# EAGLE design Nodino-CM4 (EAGLE 6.5.0)
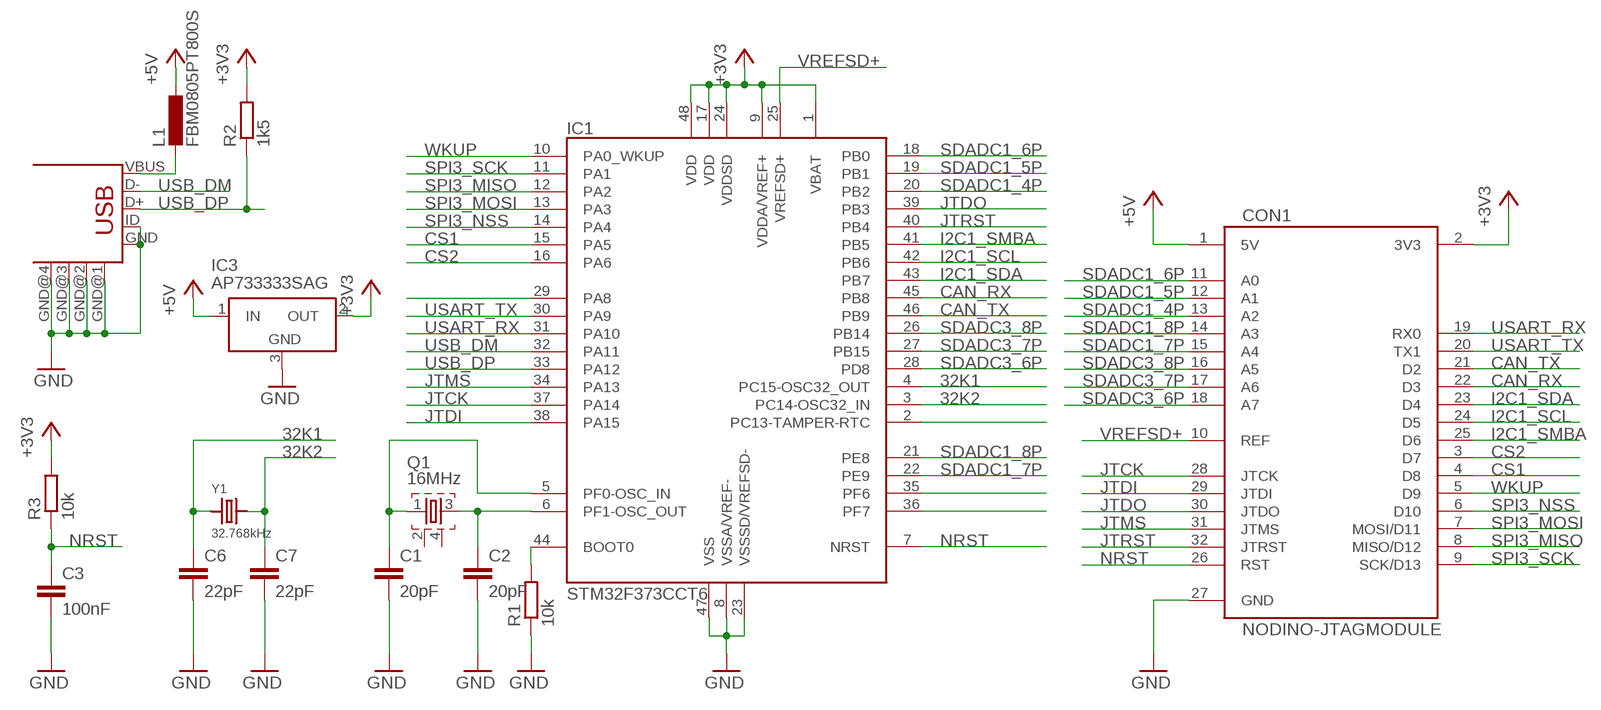
[diagram p0: schematic, sheet 1]

## Parts
C1  20pF  C-EUC0603K  [C0603K]
C2  20pF  C-EUC0603K  [C0603K]
C3  100nF  C-EUC0603K  [C0603K]
C6  22pF  C-EUC0603K  [C0603K]
C7  22pF  C-EUC0603K  [C0603K]
CON1  NODINO-JTAGMODULE  [NODINO-JTAG-MOD]
CON2  USB-OTG_SHIELD  [USB-UAB-S1]
IC1  STM32F373CCT6  [LQFP48]
IC3  AP733333SAG  [SOT23]
L1  FBM0805PT800S  L-EUL0805  [L0805]
Q1  16MHz  FA-20H  [FA-20H]
R1  10k  R-EU_R0603K  [R0603K]
R2  1k5  R-EU_R0603K  [R0603K]
R3  10k  R-EU_R0603K  [R0603K]
Y1  32.768kHz  CRYSTAL.ABS07  [ABS07]

## Nets
32K1: C6.1 IC1.4(PC15-OSC32_OUT) Y1.1
32K2: C7.1 IC1.3(PC14-OSC32_IN) Y1.2
+3V3: CON1.2(3V3) IC1.1(VBAT) IC1.9(VDDA/VREF+) IC1.17(VDD) IC1.24(VDDSD) IC1.48(VDD) IC3.2(OUT) R2.2 R3.2
+5V: CON1.1(5V) IC3.1(IN) L1.1
CAN_RX: CON1.22(D3) IC1.45(PB8)
CAN_TX: CON1.21(D2) IC1.46(PB9)
CS1: CON1.4(D8) IC1.15(PA5)
CS2: CON1.3(D7) IC1.16(PA6)
GND: C1.2 C2.2 C3.2 C6.2 C7.2 CON1.27(GND) CON2.GND CON2.GND@1(GND) CON2.GND@2(GND) CON2.GND@3(GND) CON2.GND@4(GND) CON2.ID IC1.8(VSSA/VREF-) IC1.23(VSSSD/VREFSD-) IC1.47(VSS) IC3.3(GND) R1.1
I2C1_SCL: CON1.24(D5) IC1.42(PB6)
I2C1_SDA: CON1.23(D4) IC1.43(PB7)
I2C1_SMBA: CON1.25(D6) IC1.41(PB5)
JTCK: CON1.28(JTCK) IC1.37(PA14)
JTDI: CON1.29(JTDI) IC1.38(PA15)
JTDO: CON1.30(JTDO) IC1.39(PB3)
JTMS: CON1.31(JTMS) IC1.34(PA13)
JTRST: CON1.32(JTRST) IC1.40(PB4)
N$1: CON2.VBUS L1.2
N$6: IC1.44(BOOT0) R1.2
N$7: C2.1 IC1.6(PF1-OSC_OUT) Q1.3
N$8: C1.1 IC1.5(PF0-OSC_IN) Q1.1
NRST: C3.1 CON1.26(RST) IC1.7(NRST) R3.1
PA8: IC1.29(PA8)
PC13: IC1.2(PC13-TAMPER-RTC)
PF6: IC1.35(PF6)
PF7: IC1.36(PF7)
SDADC1_4P: CON1.13(A2) IC1.20(PB2)
SDADC1_5P: CON1.12(A1) IC1.19(PB1)
SDADC1_6P: CON1.11(A0) IC1.18(PB0)
SDADC1_7P: CON1.15(A4) IC1.22(PE9)
SDADC1_8P: CON1.14(A3) IC1.21(PE8)
SDADC3_6P: CON1.18(A7) IC1.28(PD8)
SDADC3_7P: CON1.17(A6) IC1.27(PB15)
SDADC3_8P: CON1.16(A5) IC1.26(PB14)
SPI3_MISO: CON1.8(MISO/D12) IC1.12(PA2)
SPI3_MOSI: CON1.7(MOSI/D11) IC1.13(PA3)
SPI3_NSS: CON1.6(D10) IC1.14(PA4)
SPI3_SCK: CON1.9(SCK/D13) IC1.11(PA1)
USART_RX: CON1.19(RX0) IC1.31(PA10)
USART_TX: CON1.20(TX1) IC1.30(PA9)
USB_DM: CON2.D- IC1.32(PA11)
USB_DP: CON2.D+ IC1.33(PA12) R2.1
VREFSD+: CON1.10(REF) IC1.25(VREFSD+)
WKUP: CON1.5(D9) IC1.10(PA0_WKUP)
Unconnected: Q1.2 Q1.4

## Library data of the parts
C1-C3 C6 C7 = resistor:C-EU: CAPACITOR, European symbol
CON1 = nodino:NODINO-JTAG
CON2 = con-usb-2:USB-OTG_SHIELD
IC1 = stm32fxxx:STM32F373C
IC3 = diodes_inc:AP7333
L1 = resistor:L-EU: INDUCTOR, European symbol
Q1 = crystal:FA-: MHz RANGE CRYSTAL UNIT Source: Epson Toyocom
R1-R3 = resistor:R-EU_: RESISTOR, European symbol
Y1 = abracon:CRYSTAL

## Board
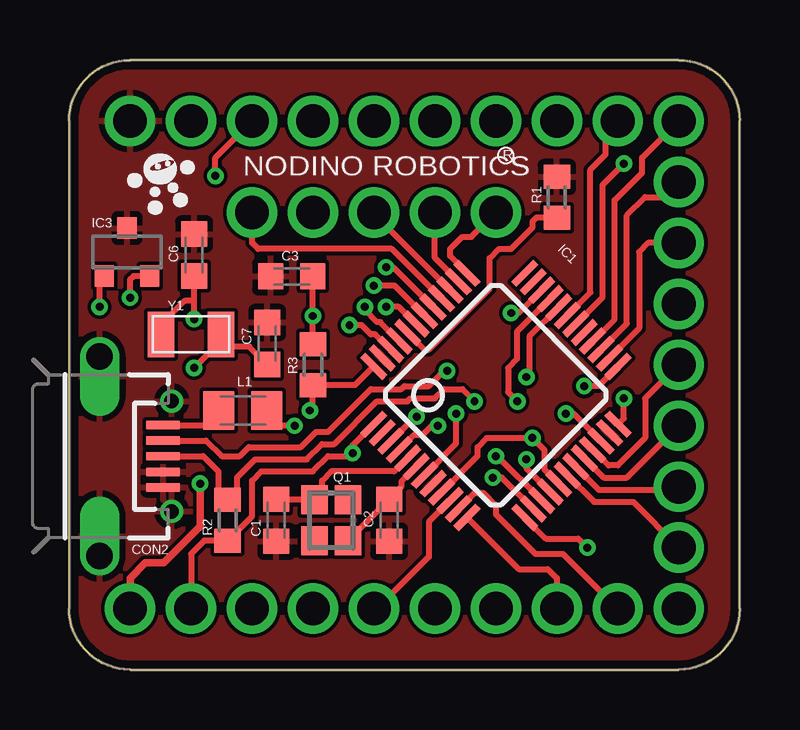
[diagram p1: board, top side]
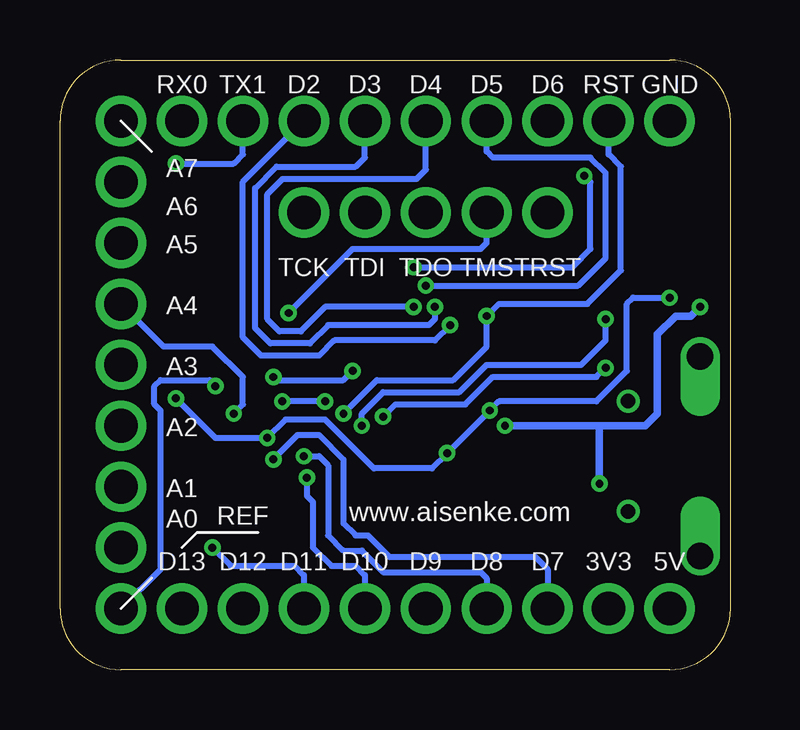
[diagram p2: board, bottom side, seen from below]

Size 27.94 x 25.4 mm. Coordinates in mm from the lower left corner, seen from the top.
Outline: 0,2.54 0,22.86 arc-90 2.54,25.4 25.4,25.4 arc-90 27.94,22.86 27.94,2.54 arc-90 25.4,0 2.54,0 arc-90 0,2.54
Copper layers (1*16): Top 0.0356mm / dielectric 1.5011mm / Bottom 0.0356mm
Design rules "LaenPCBOrder": minimum track width 6mil, minimum drill 13mil, track to track 6mil, track to pad 6mil, pad to pad 6mil, via to via 6mil, smd to smd 6mil, copper to edge 15mil, drill to drill 6mil, minimum pad ring 7mil, minimum via ring 7mil, stop-mask expansion 3mil, vias tented up to drill 0mil, thermal gap 10mil

### Footprints (pad centres in the part's own frame; a part is rotated, then mirrored left to right if it is on the bottom)
C0603K = smd 1.05 x 1.08: 1 -0.875,0; 2 0.875,0
NODINO-JTAG-MOD = drill 1.4 pad 2.1: 1 -11.43,-10.16; 2 -8.89,-10.16; 3 -6.35,-10.16; 4 -3.81,-10.16; 5 -1.27,-10.16; 6 1.27,-10.16; 7 3.81,-10.16; 8 6.35,-10.16; 9 8.89,-10.16; 10 11.43,-10.16; 11 11.43,-7.62; 12 11.43,-5.08; 13 11.43,-2.54; 14 11.43,0; 15 11.43,2.54; 16 11.43,5.08; 17 11.43,7.62; 18 11.43,10.16; 19 8.89,10.16; 20 6.35,10.16; 21 3.81,10.16; 22 1.27,10.16; 23 -1.27,10.16; 24 -3.81,10.16; 25 -6.35,10.16; 26 -8.89,10.16; 27 -11.43,10.16; 28 3.81,6.35; 29 1.27,6.35; 30 -1.27,6.35; 31 -3.81,6.35; 32 -6.35,6.35
USB-UAB-S1 = smd 0.35 x 1.4: D+ 0,2.65; D- -0.65,2.65; GND 1.3,2.65; ID 0.65,2.65; VBUS -1.3,2.65 | drill 0.6: GND@1 -2.3,3; GND@2 2.3,3 | drill 1.1 offset: GND@3 -4.15,0; GND@4 4.15,0
LQFP48 = smd 0.3 x 1.3: 1 -2.75,-4.45; 2 -2.25,-4.45; 3 -1.75,-4.45; 4 -1.25,-4.45; 5 -0.75,-4.45; 6 -0.25,-4.45; 7 0.25,-4.45; 8 0.75,-4.45; 9 1.25,-4.45; 10 1.75,-4.45; 11 2.25,-4.45; 12 2.75,-4.45; 25 2.75,4.45; 26 2.25,4.45; 27 1.75,4.45; 28 1.25,4.45; 29 0.75,4.45; 30 0.25,4.45; 31 -0.25,4.45; 32 -0.75,4.45; 33 -1.25,4.45; 34 -1.75,4.45; 35 -2.25,4.45; 36 -2.75,4.45 | smd 1.3 x 0.3: 13 4.45,-2.75; 14 4.45,-2.25; 15 4.45,-1.75; 16 4.45,-1.25; 17 4.45,-0.75; 18 4.45,-0.25; 19 4.45,0.25; 20 4.45,0.75; 21 4.45,1.25; 22 4.45,1.75; 23 4.45,2.25; 24 4.45,2.75; 37 -4.45,2.75; 38 -4.45,2.25; 39 -4.45,1.75; 40 -4.45,1.25; 41 -4.45,0.75; 42 -4.45,0.25; 43 -4.45,-0.25; 44 -4.45,-0.75; 45 -4.45,-1.25; 46 -4.45,-1.75; 47 -4.45,-2.25; 48 -4.45,-2.75
SOT23 = smd 0.8 x 0.9: 1 -0.95,-1; 2 0.95,-1; 3 0,1
L0805 = smd 1.3 x 1.6: 1 -1,0; 2 1,0
FA-20H = smd 1.2 x 1.1: 1 -0.85,-0.7; 2 0.85,-0.7; 3 0.85,0.7; 4 -0.85,0.7
R0603K = smd 1 x 1.1: 1 -0.85,0; 2 0.85,0
ABS07 = smd 1.1 x 1.9: 1 -1.25,0; 2 1.25,0

### Placement (x,y rotation side)
C1  8.64,6.22 270 top
C2  13.34,6.22 270 top
C3  9.27,16.38 180 top
C6  5.21,17.27 90 top
C7  8.26,13.59 90 top
CON1  13.97,12.7 0 top
CON2  1.27,8.89 270 top
IC1  17.78,11.43 315 top
IC3  2.41,17.4 0 top
L1  7.24,10.79 180 top
Q1  10.92,6.22 270 top
R1  20.32,19.68 270 top
R2  6.6,6.22 270 top
R3  10.16,12.7 270 top
Y1  5.08,13.97 0 top

### Tracks (layer width: path | path; a pad name or v marks a point on that pad's centre or on a via)
32K1  (via drill 0.33)
  Top 0.254: IC1.4 14.36,9.78 14.73,9.78 15.11,10.16 v15.37,10.16 | 5.21,15.37 4.83,15.37 3.83,14.37 Y1.1 | v5.21,14.61 5.21,15.37 | 5.21,15.37 C6.1
  Bottom 0.254: v15.37,10.16 15.37,10.67 14.48,11.56 11.3,11.56 10.16,12.7 6.22,12.7 5.21,13.72 v5.21,14.61
32K2  (via drill 0.33)
  Top 0.254: v14.48,10.54 14.42,10.54 IC1.3 | C7.1 7.51,13.46 6.73,13.46 6.33,13.86 Y1.2 6.33,13.7 v5.21,12.57
  Bottom 0.254: v14.48,10.54 13.97,11.05 11.05,11.05 9.91,12.19 5.59,12.19 v5.21,12.57
+3V3  (via drill 0.33)
  Top 0.254: IC1.24 23.11,10.47 v23.11,11.3 | IC1.9 17.02,8.9 17.02,9.27 17.4,9.65 v19.3,9.65 19.81,9.14 19.81,8.34 IC1.17 | CON1.2 5.08,4.83 5.63,5.37 R2.2 7.62,6.39 7.62,7.87 8,8.26 10.16,8.26 10.79,8.89 11.68,8.89 v11.81,9.02 11.81,9.35 IC1.1 | IC1.48 11.91,11.85 R3.2 10.16,10.92 v10.03,10.79 | 3.3,16.34 IC3.2 2.68,16.4 2.54,16.26 v2.54,15.49
  Bottom 0.254: v23.11,11.3 21.46,9.65 v19.3,9.65 18.54,10.41 16.89,10.41 14.86,8.38 12.45,8.38 v11.81,9.02 v10.03,10.79 9.65,11.18 5.59,11.18 4.32,12.45 4.32,15.24 4.06,15.49 v2.54,15.49
+5V  (via drill 0.33)
  Top 0.254: v9.4,10.16 8.75,10.16 L1.1 | v1.27,15.11 1.27,16.21 IC3.1
  Top 0.305: CON1.1 2.54,3.81 3.17,4.45 3.94,4.45 5.46,5.97 v5.46,7.75
  Bottom 0.305: v5.46,7.75 5.46,10.16 | 5.46,10.16 v9.4,10.16 | 5.46,10.16 3.56,10.16 3.05,10.67 3.05,13.97 2.29,14.73 1.65,14.73 v1.27,15.11
CAN_RX  (via drill 0.33)
  Top 0.254: IC1.45 12.96,14.48 12.83,14.48 12.32,14.99 v12.32,15.11
  Bottom 0.254: v12.32,15.11 12.32,14.61 12.57,14.35 16.76,14.35 17.53,13.59 19.18,13.59 19.81,14.22 19.81,20.07 18.92,20.95 15.62,20.95 15.24,21.34 CON1.22
CAN_TX  (via drill 0.33)
  Top 0.254: IC1.46 12.77,13.97 12.57,13.97 12.19,14.35 v11.68,14.35
  Bottom 0.254: v11.68,14.35 12.32,13.72 16.51,13.72 17.14,13.08 19.56,13.08 20.32,13.84 20.32,20.32 CON1.21
CS1  (via drill 0.33)
  Top 0.254: IC1.15 17.84,8.89 v17.78,8.89
  Bottom 0.254: v17.78,8.89 17.14,8.89 16.76,8.51 16.76,5.59 16.13,4.95 15.37,4.95 14.48,4.06 10.41,4.06 10.16,3.81 CON1.4
CS2  (via drill 0.33)
  Top 0.254: IC1.16 19.05,8.39 v19.05,8.76
  Bottom 0.254: v19.05,8.76 18.03,9.78 17.14,9.78 16.13,8.76 16.13,6.1 15.62,5.59 15.11,5.59 14.22,4.7 8.13,4.7 7.62,4.19 CON1.3
GND
  pour Top: 0,25.4 27.94,25.4 27.94,0 0,0
I2C1_SCL  (via drill 0.33)
  Top 0.254: IC1.42 13.56,16 v12.7,16
  Bottom 0.254: v12.7,16 6.35,16 5.21,17.14 5.21,20.7 5.84,21.34 9.91,21.34 10.16,21.59 CON1.24
I2C1_SDA  (via drill 0.33)
  Top 0.254: IC1.43 13.74,15.11 v13.21,15.11
  Bottom 0.254: CON1.23 12.7,20.83 13.08,20.45 18.67,20.45 19.3,19.81 19.3,14.61 18.8,14.1 17.91,14.1 16.89,15.11 v13.21,15.11
I2C1_SMBA  (via drill 0.33)
  Top 0.254: IC1.41 13.51,16.76 v13.21,16.76 | v6.1,20.57 6.1,21.34 CON1.25
  Bottom 0.254: v13.21,16.76 6.6,16.76 5.84,17.53 5.84,20.32 v6.1,20.57
JTCK
  Top 0.254: IC1.37 15.88,17.22 15.88,17.53 16.38,18.03 16.76,18.03 CON1.28
JTDI
  Top 0.254: IC1.38 15.24,17.15 CON1.29
JTDO
  Top 0.254: IC1.39 12.7,18.98 CON1.30
JTMS  (via drill 0.33)
  Top 0.254: IC1.34 18.73,14.86 v18.41,14.86
  Bottom 0.254: v18.41,14.86 15.75,17.53 10.41,17.53 10.16,17.78 CON1.31
JTRST
  Top 0.254: IC1.40 13.45,17.53 7.87,17.53 7.62,17.78 CON1.32
N$1
  Top 0.254: CON2.VBUS 5.63,10.19 L1.2
N$6
  Top 0.254: IC1.44 14.81,13.34 14.99,13.34 17.53,15.88 17.53,17.14 17.91,17.53 18.41,17.53 19.3,18.41 19.3,18.67 19.47,18.84 R1.2
N$7
  Top 0.254: IC1.6 13.84,7.85 13.84,7.62 13.34,7.11 C2.1 11.62,5.38 Q1.3
N$8
  Top 0.254: IC1.5 13.54,8.26 10.92,8.26 10.54,7.87 10.54,7.39 Q1.1 8.79,7.07 C1.1
NRST  (via drill 0.33)
  Top 0.254: IC1.7 16.13,9.43 v16.13,10.67 | R3.1 v10.16,14.73 C3.1
  Bottom 0.254: v16.13,10.67 14.73,12.06 11.56,12.06 10.16,13.46 v10.16,14.73 9.65,15.24 5.97,15.24 4.57,16.64 4.57,20.95 5.08,21.46 CON1.26
SDADC1_4P
  Top 0.254: IC1.20 22.27,8 23.24,8 CON1.13
SDADC1_5P
  Top 0.254: IC1.19 22.07,7.49 25.27,7.49 CON1.12
SDADC1_6P
  Top 0.254: IC1.18 21.87,6.99 23.5,6.99 CON1.11
SDADC1_7P  (via drill 0.33)
  Top 0.254: IC1.22 21.02,10.67 v20.7,10.67
  Bottom 0.254: v20.7,10.67 20.32,11.05 20.32,12.19 21.59,13.46 23.62,13.46 CON1.15
SDADC1_8P
  Top 0.254: CON1.14 24,11.3 24,9.65 22.86,8.51 22.48,8.51 21.82,9.17 IC1.21
SDADC3_6P
  Top 0.254: IC1.28 21.82,13.69 22.73,14.61 22.73,19.56 23.88,20.7 23.88,21.34 CON1.18
SDADC3_7P
  Top 0.254: IC1.27 23.24,14.42 23.24,18.92 24,19.68 24.77,19.68 CON1.17
SDADC3_8P
  Top 0.254: CON1.16 24.13,17.78 23.75,17.4 23.75,14.22 IC1.26
SPI3_MISO
  Top 0.254: IC1.12 18.73,4.19 19.94,4.19 20.32,3.81 CON1.8
SPI3_MOSI  (via drill 0.33)
  Top 0.254: IC1.13 19.86,5.46 21.21,5.46 v21.59,5.08
  Bottom 0.254: v21.59,5.08 20.83,4.32 18.16,4.32 17.78,3.94 CON1.7
SPI3_NSS  (via drill 0.33)
  Top 0.254: IC1.14 18.03,7.99 v17.65,8
  Bottom 0.254: v17.65,8 17.65,7.24 17.4,6.99 17.4,5.08 16.64,4.32 15.62,4.32 15.24,3.94 CON1.6
SPI3_SCK
  Top 0.254: IC1.11 16.9,7.37 17.27,7.37 17.78,6.86 17.78,6.48 19.43,4.83 20.57,4.83 CON1.9
USART_RX
  Top 0.254: IC1.31 21.72,15.72 21.72,20.83 22.35,21.46 22.35,22.35 CON1.19
USART_TX  (via drill 0.33)
  Top 0.254: IC1.30 22.23,15.52 22.23,20.19 v23.11,21.08
  Bottom 0.254: v23.11,21.08 20.7,21.08 20.32,21.46 CON1.20
USB_DM  (via drill 0.33)
  Top 0.254: CON2.D- 5.7,9.54 6.35,8.89 7.11,8.89 7.49,9.27 9.65,9.27 10.29,9.91 10.79,9.91 12.57,11.68 13.84,11.68 13.97,11.81 14.99,11.81 15.62,12.45 v15.75,12.45 | IC1.32 19.18,13.89 19.18,12.32 v19.05,12.19
  Bottom 0.254: v19.05,12.19 18.92,12.06 16.13,12.06 v15.75,12.45
USB_DP  (via drill 0.33)
  Top 0.254: CON2.D+ 5.59,8.89 6.22,8.26 6.22,7.45 R2.1 6.99,7.45 6.99,8 7.75,8.76 9.91,8.76 10.54,9.4 11.05,9.4 12.83,11.18 14.1,11.18 14.22,11.3 15.24,11.3 15.62,11.68 16.38,11.68 v16.89,11.18 | IC1.33 18.67,14.1 18.67,12.94 18.29,12.56 18.29,11.56 v18.67,11.18 v18.68,11.18
  Bottom 0.254: v16.89,11.18 v18.68,11.18
VREFSD+  (via drill 0.33 pad 0.33)
  Top 0.254: IC1.25 22.05,11.81 v21.46,11.81
  Bottom 0.254: CON1.10 23.75,4.19 23.75,10.79 24,11.05 24,11.81 23.75,12.06 21.72,12.06 v21.46,11.81
WKUP
  Top 0.254: IC1.10 14.99,6.16 14.99,4.7 12.83,2.54 CON1.5

### Text on the board
tPlace: NODINO ROBOTICS | R
bPlace: www.aisenke.com